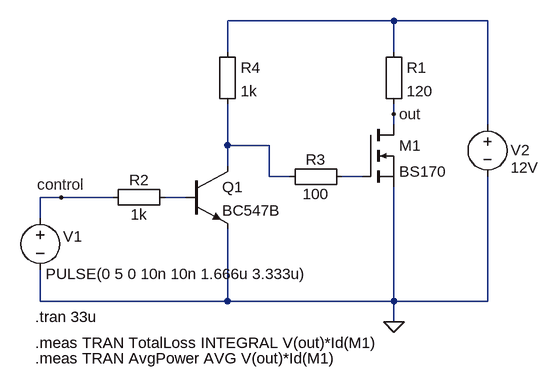
[diagram p0: schematic MOSFET_Switch_alt.asc]
MOSFET_Switch_alt.asc, the LTspice schematic file:
Version 4.1
SHEET 1 1292 680
WIRE -832 -336 -1088 -336
WIRE -688 -336 -832 -336
WIRE -1088 -288 -1088 -336
WIRE -832 -288 -832 -336
WIRE -832 -192 -832 -208
WIRE -832 -176 -832 -192
WIRE -688 -176 -688 -336
WIRE -1088 -144 -1088 -208
WIRE -1024 -144 -1088 -144
WIRE -1088 -112 -1088 -144
WIRE -1024 -96 -1024 -144
WIRE -992 -96 -1024 -96
WIRE -880 -96 -912 -96
WIRE -1344 -64 -1376 -64
WIRE -1264 -64 -1344 -64
WIRE -1152 -64 -1184 -64
WIRE -1376 -32 -1376 -64
WIRE -1376 96 -1376 48
WIRE -1088 96 -1088 -16
WIRE -1088 96 -1376 96
WIRE -832 96 -832 -80
WIRE -832 96 -1088 96
WIRE -688 96 -688 -96
WIRE -688 96 -832 96
WIRE -832 128 -832 96
FLAG -832 128 0
FLAG -1344 -64 control
FLAG -832 -192 out
SYMBOL voltage -688 -192 R0
WINDOW 123 0 0 Left 2
WINDOW 39 37 60 Left 2
WINDOW 0 36 55 Left 2
WINDOW 3 36 82 Left 2
SYMATTR InstName V2
SYMATTR Value 12V
SYMBOL voltage -1376 -48 R0
WINDOW 123 0 0 Left 2
WINDOW 3 8 102 Left 2
WINDOW 0 35 44 Left 2
WINDOW 39 -81 178 Left 2
SYMATTR Value PULSE(0 5 0 10n 10n 1.666u 3.333u)
SYMATTR InstName V1
SYMBOL nmos -880 -176 R0
SYMATTR InstName M1
SYMATTR Value BS170
SYMBOL Misc\\EuropeanResistor -848 -304 R0
SYMATTR InstName R1
SYMATTR Value 120
SYMBOL Misc\\EuropeanResistor -896 -112 R90
WINDOW 0 5 56 VBottom 2
WINDOW 3 27 56 VTop 2
SYMATTR InstName R3
SYMATTR Value 100
SYMBOL npn -1152 -112 R0
SYMATTR InstName Q1
SYMATTR Value BC547B
SYMBOL Misc\\EuropeanResistor -1168 -80 R90
WINDOW 0 5 56 VBottom 2
WINDOW 3 27 56 VTop 2
SYMATTR InstName R2
SYMATTR Value 1k
SYMBOL Misc\\EuropeanResistor -1104 -304 R0
SYMATTR InstName R4
SYMATTR Value 1k
TEXT -1384 120 Left 2 !.tran 33u
TEXT -1384 160 Left 2 !.meas TRAN TotalLoss INTEGRAL V(out)*Id(M1)
TEXT -1384 184 Left 2 !.meas TRAN AvgPower AVG V(out)*Id(M1)

The netlist it stands for:
* MOSFET_Switch_alt.asc
V2 N001 0 12V
V1 control 0 PULSE(0 5 0 10n 10n 1.666u 3.333u)
M1 out N003 0 0 BS170
R1 N001 out 120
R3 N003 N002 100
Q1 N002 N004 0 0 BC547B
R2 N004 control 1k
R4 N001 N002 1k
.model NPN NPN
.model PNP PNP
.lib standard.bjt
.model NMOS NMOS
.model PMOS PMOS
.lib standard.mos
.tran 33u
.meas TRAN TotalLoss INTEGRAL V(out)*Id(M1)
.meas TRAN AvgPower AVG V(out)*Id(M1)
.backanno
.end